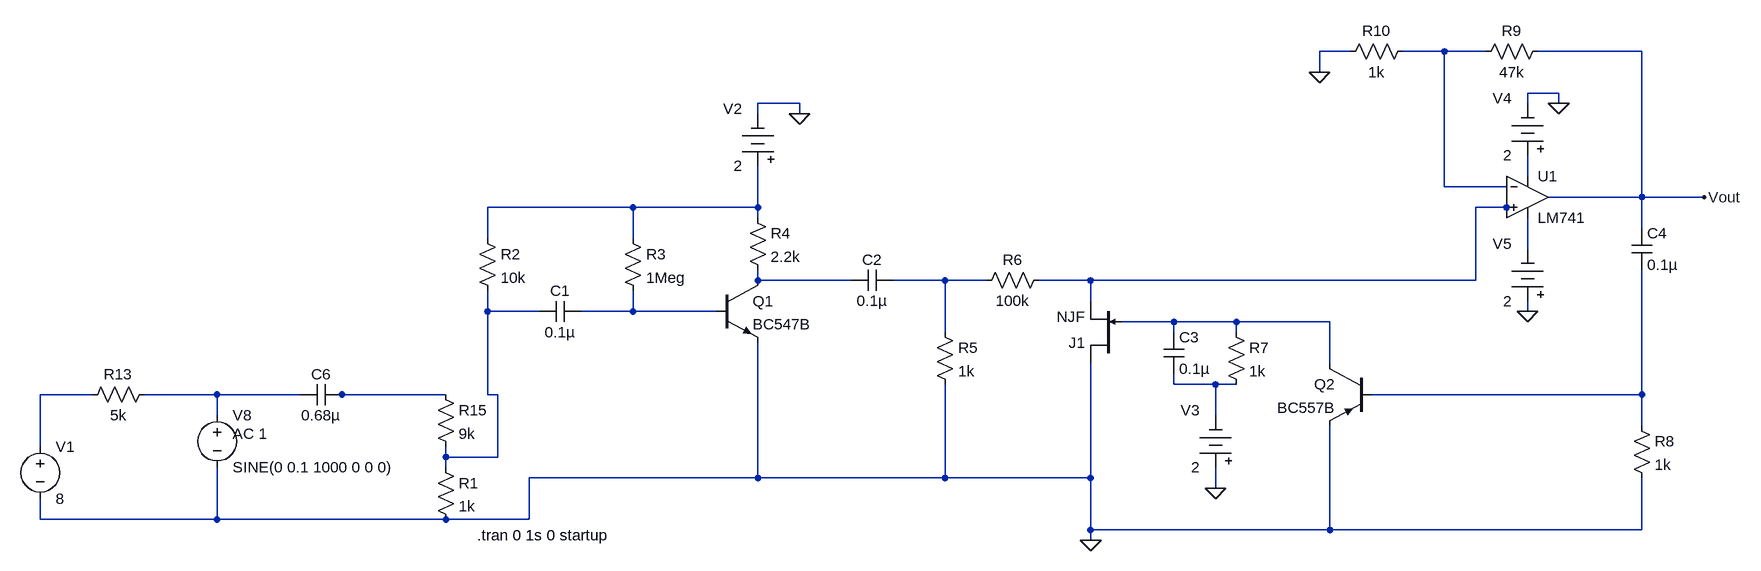
[diagram p0: schematic AEC PROJECT JOINT - Copy.asc]
AEC PROJECT JOINT - Copy.asc, the LTspice schematic file:
Version 4
SHEET 1 1160 680
WIRE 544 -320 496 -320
WIRE 688 -320 624 -320
WIRE 752 -320 688 -320
WIRE 992 -320 832 -320
WIRE 496 -288 496 -320
WIRE 864 -256 816 -256
WIRE -304 -240 -368 -240
WIRE 816 -240 816 -256
WIRE 864 -240 864 -256
WIRE -368 -224 -368 -240
WIRE -304 -224 -304 -240
WIRE 816 -128 816 -160
WIRE 688 -112 688 -320
WIRE 784 -112 688 -112
WIRE 992 -96 992 -320
WIRE 992 -96 848 -96
WIRE 1088 -96 992 -96
WIRE -560 -80 -784 -80
WIRE -368 -80 -368 -144
WIRE -368 -80 -560 -80
WIRE 784 -80 736 -80
WIRE 800 -80 784 -80
WIRE -368 -64 -368 -80
WIRE 992 -48 992 -96
WIRE -784 -32 -784 -80
WIRE -560 -32 -560 -80
WIRE 816 -16 816 -64
WIRE -368 32 -368 16
WIRE -224 32 -368 32
WIRE -80 32 -160 32
WIRE -16 32 -80 32
WIRE 144 32 64 32
WIRE 736 32 736 -80
WIRE 736 32 144 32
WIRE 144 64 144 32
WIRE -784 80 -784 48
WIRE -704 80 -784 80
WIRE -560 80 -560 48
WIRE -560 80 -640 80
WIRE -432 80 -560 80
WIRE 816 80 816 64
WIRE 272 96 192 96
WIRE 368 96 272 96
WIRE 512 96 368 96
WIRE -80 112 -80 32
WIRE 272 112 272 96
WIRE 368 112 368 96
WIRE 512 160 512 96
WIRE 272 192 272 176
WIRE 336 192 272 192
WIRE 368 192 336 192
WIRE -1392 208 -1472 208
WIRE -1200 208 -1312 208
WIRE -1072 208 -1200 208
WIRE -1008 208 -1024 208
WIRE -848 208 -1008 208
WIRE -784 208 -784 80
WIRE -768 208 -784 208
WIRE 992 208 992 16
WIRE 992 208 576 208
WIRE -1200 240 -1200 208
WIRE 336 240 336 192
WIRE 992 256 992 208
WIRE -1472 288 -1472 208
WIRE -848 304 -848 288
WIRE -768 304 -768 208
WIRE -768 304 -848 304
WIRE -848 320 -848 304
WIRE -368 336 -368 128
WIRE -368 336 -720 336
WIRE -80 336 -80 192
WIRE -80 336 -368 336
WIRE 144 336 144 160
WIRE 144 336 -80 336
WIRE 336 352 336 320
WIRE -1472 400 -1472 368
WIRE -1200 400 -1200 320
WIRE -1200 400 -1472 400
WIRE -848 400 -1200 400
WIRE -720 400 -720 336
WIRE -720 400 -848 400
WIRE 144 416 144 336
WIRE 512 416 512 256
WIRE 512 416 144 416
WIRE 992 416 992 336
WIRE 992 416 512 416
WIRE 144 432 144 416
FLAG -304 -224 0
FLAG 336 352 0
FLAG 864 -240 0
FLAG 816 80 0
FLAG 496 -288 0
FLAG 144 432 0
FLAG 1088 -96 Vout
SYMBOL res -800 -48 R0
SYMATTR InstName R2
SYMATTR Value 10k
SYMBOL res -576 -48 R0
SYMATTR InstName R3
SYMATTR Value 1Meg
SYMBOL cap -640 64 R90
WINDOW 0 0 32 VBottom 2
WINDOW 3 32 32 VTop 2
SYMATTR InstName C1
SYMATTR Value 0.1µ
SYMBOL npn2 -432 32 R0
SYMATTR InstName Q1
SYMATTR Value BC547B
SYMBOL res -384 -80 R0
SYMATTR InstName R4
SYMATTR Value 2.2k
SYMBOL cap -160 16 R90
WINDOW 0 0 32 VBottom 2
WINDOW 3 32 32 VTop 2
SYMATTR InstName C2
SYMATTR Value 0.1µ
SYMBOL res -96 96 R0
SYMATTR InstName R5
SYMATTR Value 1k
SYMBOL res 80 16 R90
WINDOW 0 0 56 VBottom 2
WINDOW 3 32 56 VTop 2
SYMATTR InstName R6
SYMATTR Value 100k
SYMBOL njf 192 160 R180
SYMATTR InstName J1
SYMBOL cap 256 112 R0
SYMATTR InstName C3
SYMATTR Value 0.1µ
SYMBOL res 352 96 R0
SYMATTR InstName R7
SYMATTR Value 1k
SYMBOL Misc\\battery -368 -128 R180
WINDOW 0 24 104 Left 2
WINDOW 3 24 16 Left 2
WINDOW 123 0 0 Left 0
WINDOW 39 0 0 Left 0
SYMATTR InstName V2
SYMATTR Value 2
SYMBOL Misc\\battery 336 336 R180
WINDOW 0 24 104 Left 2
WINDOW 3 24 16 Left 2
WINDOW 123 0 0 Left 0
WINDOW 39 0 0 Left 0
SYMATTR InstName V3
SYMATTR Value 2
SYMBOL pnp2 576 160 M0
SYMATTR InstName Q2
SYMATTR Value BC557B
SYMBOL OpAmps\\LM741 816 -160 R0
SYMATTR InstName U1
SYMBOL Misc\\battery 816 -144 R180
WINDOW 0 24 104 Left 2
WINDOW 3 24 16 Left 2
WINDOW 123 0 0 Left 0
WINDOW 39 0 0 Left 0
SYMATTR InstName V4
SYMATTR Value 2
SYMBOL Misc\\battery 816 80 R180
WINDOW 0 24 104 Left 2
WINDOW 3 24 16 Left 2
WINDOW 123 0 0 Left 0
WINDOW 39 0 0 Left 0
SYMATTR InstName V5
SYMATTR Value 2
SYMBOL cap 976 -48 R0
SYMATTR InstName C4
SYMATTR Value 0.1µ
SYMBOL res 976 240 R0
SYMATTR InstName R8
SYMATTR Value 1k
SYMBOL res 848 -336 R90
WINDOW 0 0 56 VBottom 2
WINDOW 3 32 56 VTop 2
SYMATTR InstName R9
SYMATTR Value 47k
SYMBOL res 640 -336 R90
WINDOW 0 0 56 VBottom 2
WINDOW 3 32 56 VTop 2
SYMATTR InstName R10
SYMATTR Value 1k
SYMBOL res -1296 192 R90
WINDOW 0 0 56 VBottom 2
WINDOW 3 32 56 VTop 2
SYMATTR InstName R13
SYMATTR Value 5k
SYMBOL voltage -1200 224 R0
WINDOW 123 24 44 Left 2
WINDOW 39 0 0 Left 0
SYMATTR InstName V8
SYMATTR Value SINE(0 0.1 1000 0 0 0)
SYMATTR Value2 AC 1
SYMBOL cap -1008 192 R90
WINDOW 0 0 32 VBottom 2
WINDOW 3 32 32 VTop 2
SYMATTR InstName C6
SYMATTR Value 0.68µ
SYMBOL res -864 192 R0
SYMATTR InstName R15
SYMATTR Value 9k
SYMBOL res -864 304 R0
SYMATTR InstName R1
SYMATTR Value 1k
SYMBOL voltage -1472 272 R0
WINDOW 123 0 0 Left 0
WINDOW 39 0 0 Left 0
SYMATTR InstName V1
SYMATTR Value 8
TEXT -800 424 Left 2 !.tran 0 1s 0 startup

The netlist it stands for:
* AEC PROJECT JOINT - Copy.asc
R2 N003 N008 10k
R3 N003 N009 1Meg
C1 N009 N008 0.1µ
Q1 N006 N009 0 0 BC547B
R4 N003 N006 2.2k
C2 N007 N006 0.1µ
R5 N007 0 1k
R6 N004 N007 100k
J1 0 N010 N004 NJF
C3 N010 N011 0.1µ
R7 N010 N011 1k
V2 N003 0 2
V3 0 N011 2
Q2 N010 N015 0 0 BC557B
XU1 N004 N001 N002 N005 Vout LM741  ; pins In+ In- V+ V- OUT
V4 N002 0 2
V5 0 N005 2
C4 Vout N015 0.1µ
R8 N015 0 1k
R9 Vout N001 47k
R10 N001 0 1k
R13 N013 N012 5k
V8 N013 0 SINE(0 0.1 1000 0 0 0) AC 1
C6 N014 N013 0.68µ
R15 N014 N008 9k
R1 N008 0 1k
V1 N012 0 8
.model NPN NPN
.model PNP PNP
.lib standard.bjt
.model NJF NJF
.model PJF PJF
.lib standard.jft
.tran 0 1s 0 startup
.lib LM741.lib
.backanno
.end